# EAGLE design C3427-3 (EAGLE 7.2.0)
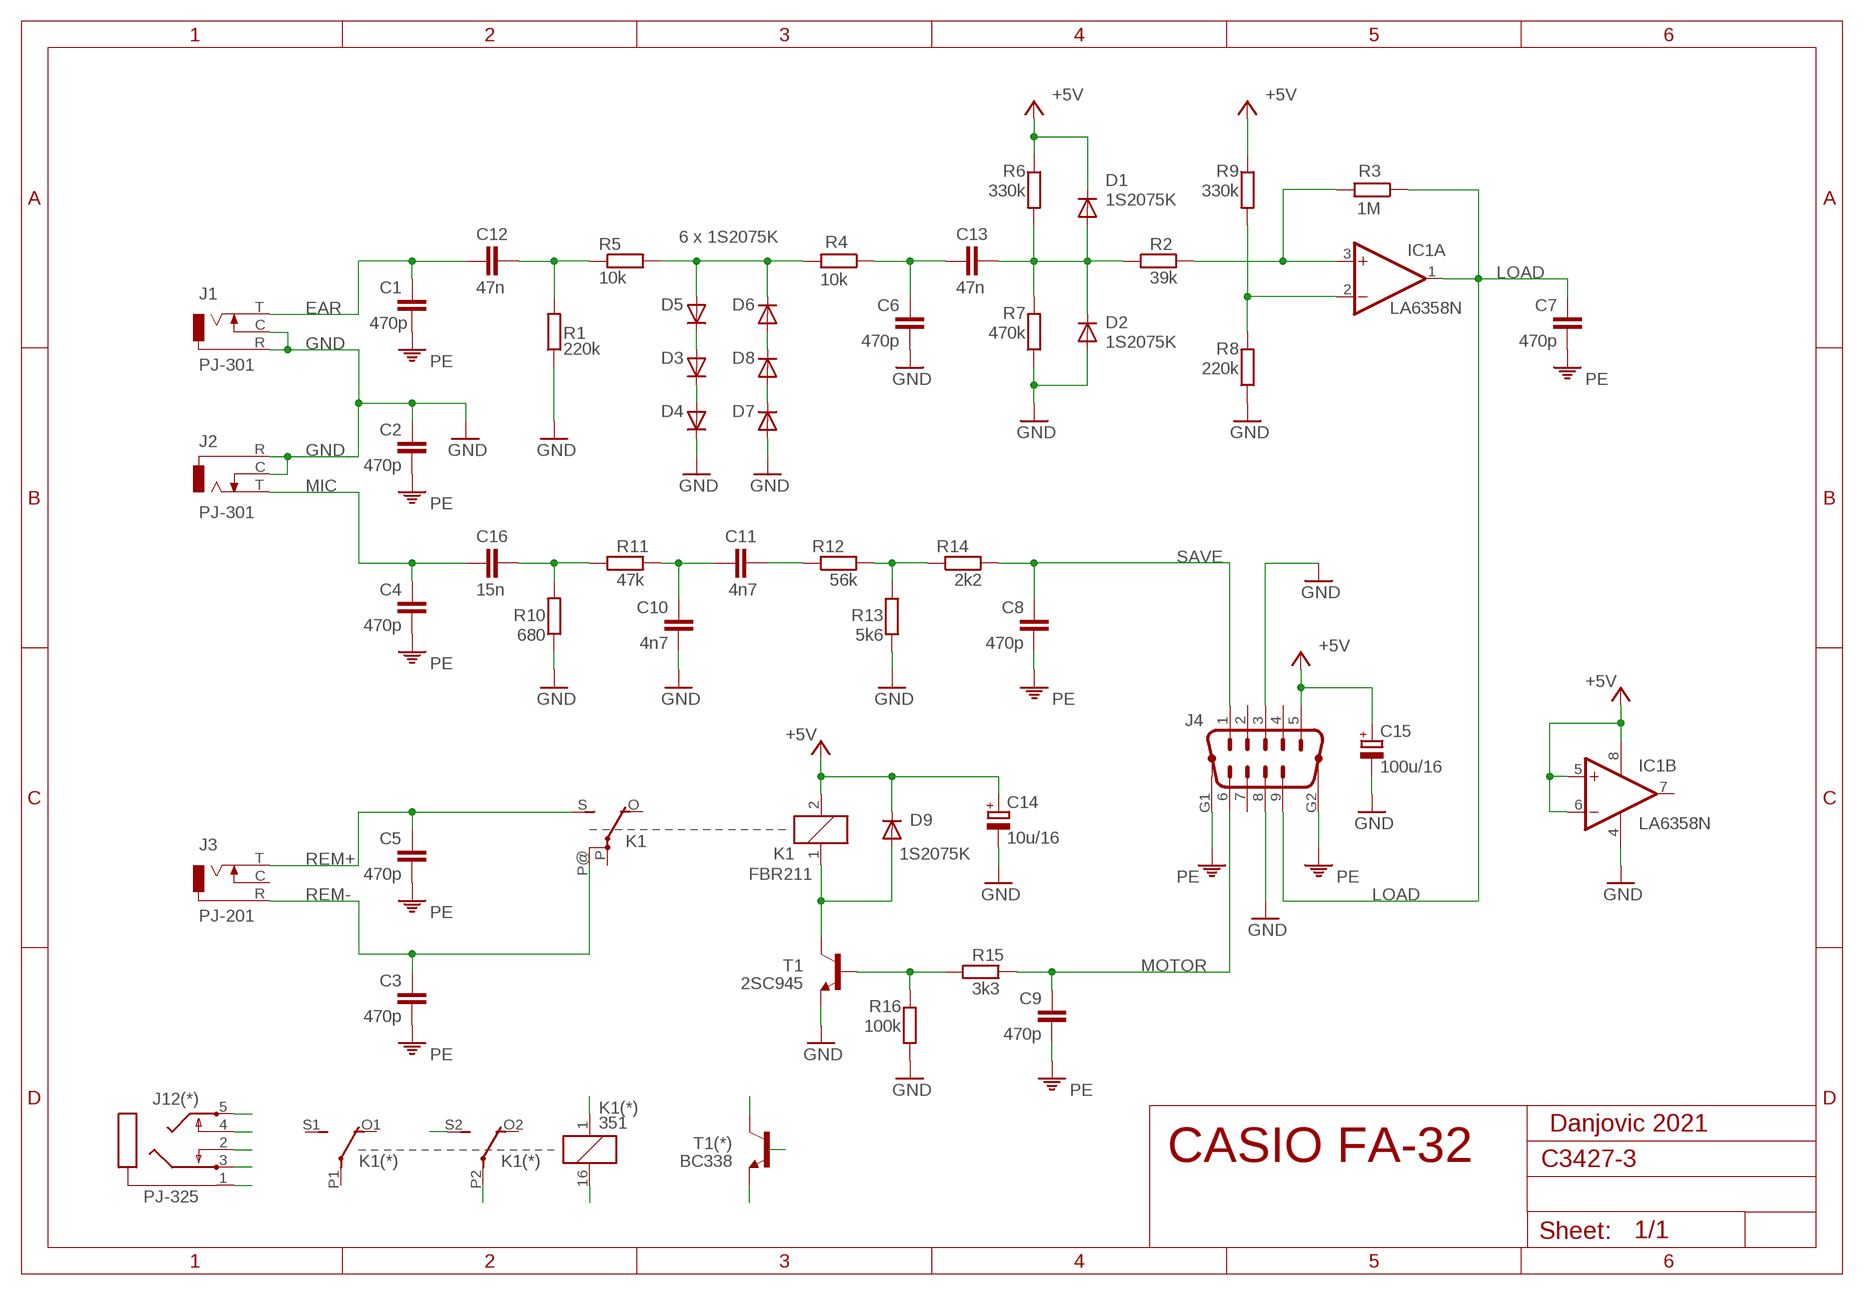
[diagram p0: schematic, sheet 1]

## Parts
C1  470p  C-EU050-024X044  [C050-024X044]
C2  470p  C-EU050-024X044  [C050-024X044]
C3  470p  C-EU050-024X044  [C050-024X044]
C4  470p  C-EU050-024X044  [C050-024X044]
C5  470p  C-EU050-024X044  [C050-024X044]
C6  470p  C-EU050-024X044  [C050-024X044]
C7  470p  C-EU050-024X044  [C050-024X044]
C8  470p  C-EU050-024X044  [C050-024X044]
C9  470p  C-EU050-024X044  [C050-024X044]
C10  4n7  C-EU050-024X044  [C050-024X044]
C11  4n7  C-EU050-024X044  [C050-024X044]
C12  47n  C-EU050-045X075  [C050-045X075]
C13  47n  C-EU050-045X075  [C050-045X075]
C14  10u/16  CPOL-EUE2-4  [E2-4]
C15  100u/16  CPOL-EUE2.5-6  [E2,5-6]
C16  15n  C-EU050-024X044  [C050-024X044]
D1  1S2075K  DIODE-D-7.5  [D-7.5]
D2  1S2075K  DIODE-D-7.5  [D-7.5]
D3  1S2075K  DIODE-D-7.5  [D-7.5]
D4  1S2075K  DIODE-D-7.5  [D-7.5]
D5  1S2075K  DIODE-D-7.5  [D-7.5]
D6  1S2075K  DIODE-D-7.5  [D-7.5]
D7  1S2075K  DIODE-D-7.5  [D-7.5]
D8  1S2075K  DIODE-D-7.5  [D-7.5]
D9  1S2075K  DIODE-D-7.5  [D-7.5]
IC1  LA6358N  LM358N  [DIL08]
J1  PJ-301  [PJ301]
J2  PJ-301  [PJ301]
J3  PJ-201  [PJ201]
J4  M09HP  [M09HP]
J12(*)  PJ-325  [PJ325]
K1  FBR211  FRS1B  [FRS1B]
K1(*)  351  [351]
R1  220k  R-EU_0204/7  [0204/7]
R2  39k  R-EU_0204/7  [0204/7]
R3  1M  R-EU_0204/7  [0204/7]
R4  10k  R-EU_0204/7  [0204/7]
R5  10k  R-EU_0204/7  [0204/7]
R6  330k  R-EU_0204/7  [0204/7]
R7  470k  R-EU_0204/7  [0204/7]
R8  220k  R-EU_0204/7  [0204/7]
R9  330k  R-EU_0204/7  [0204/7]
R10  680  R-EU_0204/7  [0204/7]
R11  47k  R-EU_0204/7  [0204/7]
R12  56k  R-EU_0204/7  [0204/7]
R13  5k6  R-EU_0204/7  [0204/7]
R14  2k2  R-EU_0204/7  [0204/7]
R15  3k3  R-EU_0204/7  [0204/7]
R16  100k  R-EU_0204/7  [0204/7]
T1  2SC945  [TO92-ECB]
T1(*)  BC338  [TO92-EBC]

## Nets
+5V: C14.+ C15.+ D1.C D9.C IC1.5(B:+IN) IC1.6(B:-IN) IC1.8(P:V+) J4.5 K1(*).1 K1.2 R6.1 R9.1
EAR: C1.2 C12.2 J1.T J12(*).5
GND: C2.2 C6.1 C10.1 C14.- C15.- D2.A D4.C D7.A IC1.4(P:V-) J1.C J1.R J2.C J2.R J4.3 J4.8 J12(*).1 J12(*).2 J12(*).4 R1.1 R7.1 R8.1 R10.1 R13.2 R16.2 T1(*).E T1.E
LOAD: C7.2 IC1.1(A:OUT) J4.9 R3.1
MIC: C4.2 C16.2 J2.T J12(*).3
MOTOR: C9.2 J4.6 R15.2
N$2: D5.A D6.C R4.2 R5.2
N$3: C12.1 R1.2 R5.1
N$4: C6.2 C13.2 R4.1
N$5: C16.1 R10.2 R11.1
N$9: D9.A K1(*).16 K1.1 T1(*).C T1.C
N$10: R15.1 R16.1 T1(*).B T1.B
N$15: D3.A D5.C
N$16: D3.C D4.A
N$17: D6.A D8.C
N$18: D7.C D8.A
N$19: C13.1 D1.A D2.C R2.1 R6.2 R7.2
N$20: R12.2 R13.1 R14.1
N$21: C10.2 C11.1 R11.2
N$22: C11.2 R12.1
N$23: IC1.2(A:-IN) R8.2 R9.2
N$25: IC1.3(A:+IN) R2.2 R3.2
PE: C1.1 C2.1 C3.1 C4.1 C5.1 C7.1 C8.1 C9.1 J4.G1 J4.G2
REM+: C5.2 J3.T K1(*).P2(3:P) K1.S(2:S)
REM-: C3.2 J3.R K1(*).S2(3:S) K1.P@(2:P)
SAVE: C8.2 J4.1 R14.2
Unconnected: IC1.7(B:OUT) J3.C J4.2 J4.4 J4.7 K1(*).O1(2:O) K1(*).O2(3:O) K1(*).P1(2:P) K1(*).S1(2:S) K1.O(2:O) K1.P(2:P)

## Notes on the sheet
- 6 x 1S2075K
- Danjovic 2021
- CASIO FA-32

## Library data of the parts
C1-C13 C16 = rcl:C-EU: CAPACITOR, European symbol
C14 C15 = rcl:CPOL-EU: POLARIZED CAPACITOR, European symbol
D1-D9 = diode:DIODE-: DIODE
IC1 = linear:LM358: OP AMP also LM158; LM258; LM2904 Source: http://cache.national.com/ds/LM/LM158.pdf
J1-J3 = Jack-PJ:PJ-: Mono Jack
J4 = con-subd:M09HP: SUB-D; OC_FARNELL: unknown; OC_NEWARK: unknown
J12(*) = AudioJack:PJ-325: Stereo Jack With Switches
K1 = relay:FRS1B: RELAY 1 x switch, same as V23101-D6-A201, Siemens; OC_FARNELL: unknown; OC_NEWARK: unknown
K1(*) = relay:351: RELAY 2 x switch, Omron; OC_FARNELL: unknown; OC_NEWARK: unknown
R1-R16 = resistor:R-EU_: RESISTOR, European symbol
T1 = transistor:2SC945: NPN Silicon Epitaxial Planar Transistor Source: SEMTECH ELECTRONICS LTD. ... 2SC945 2.pdf
T1(*) = transistor-npn:BC338*: NPN Transistor

## Board
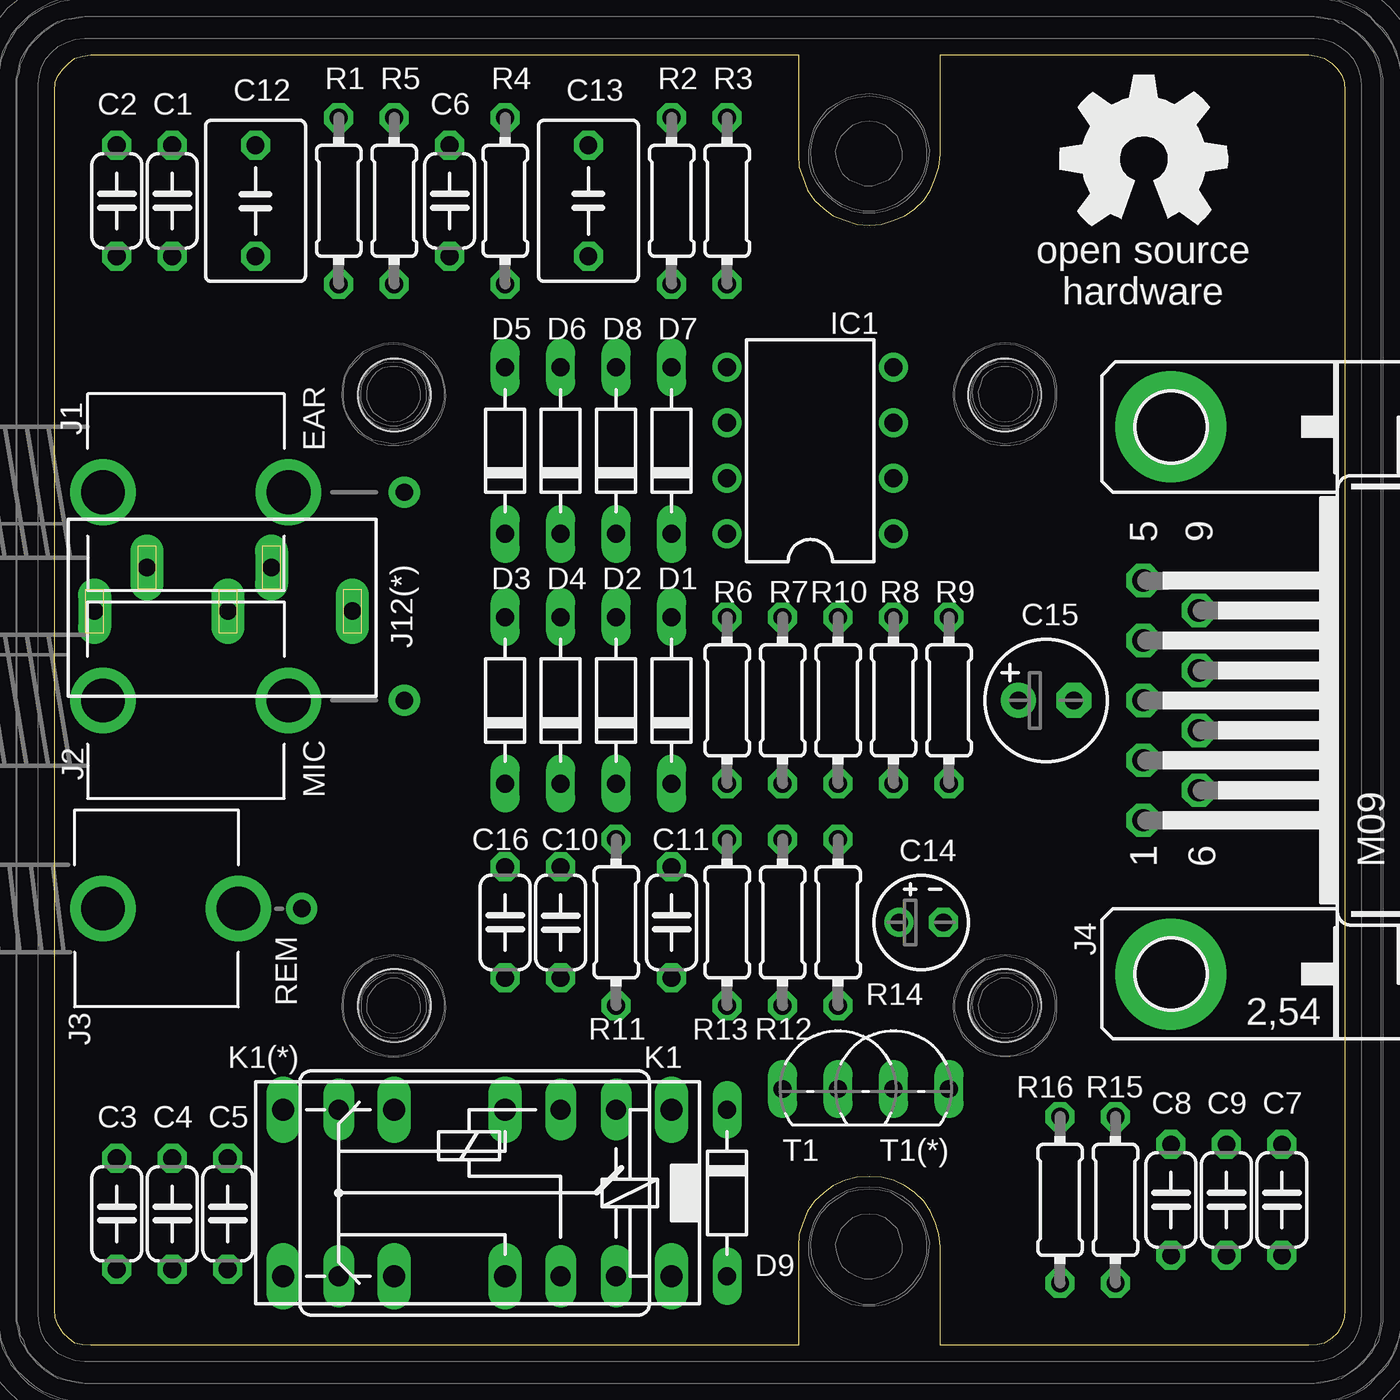
[diagram p1: board, top side]
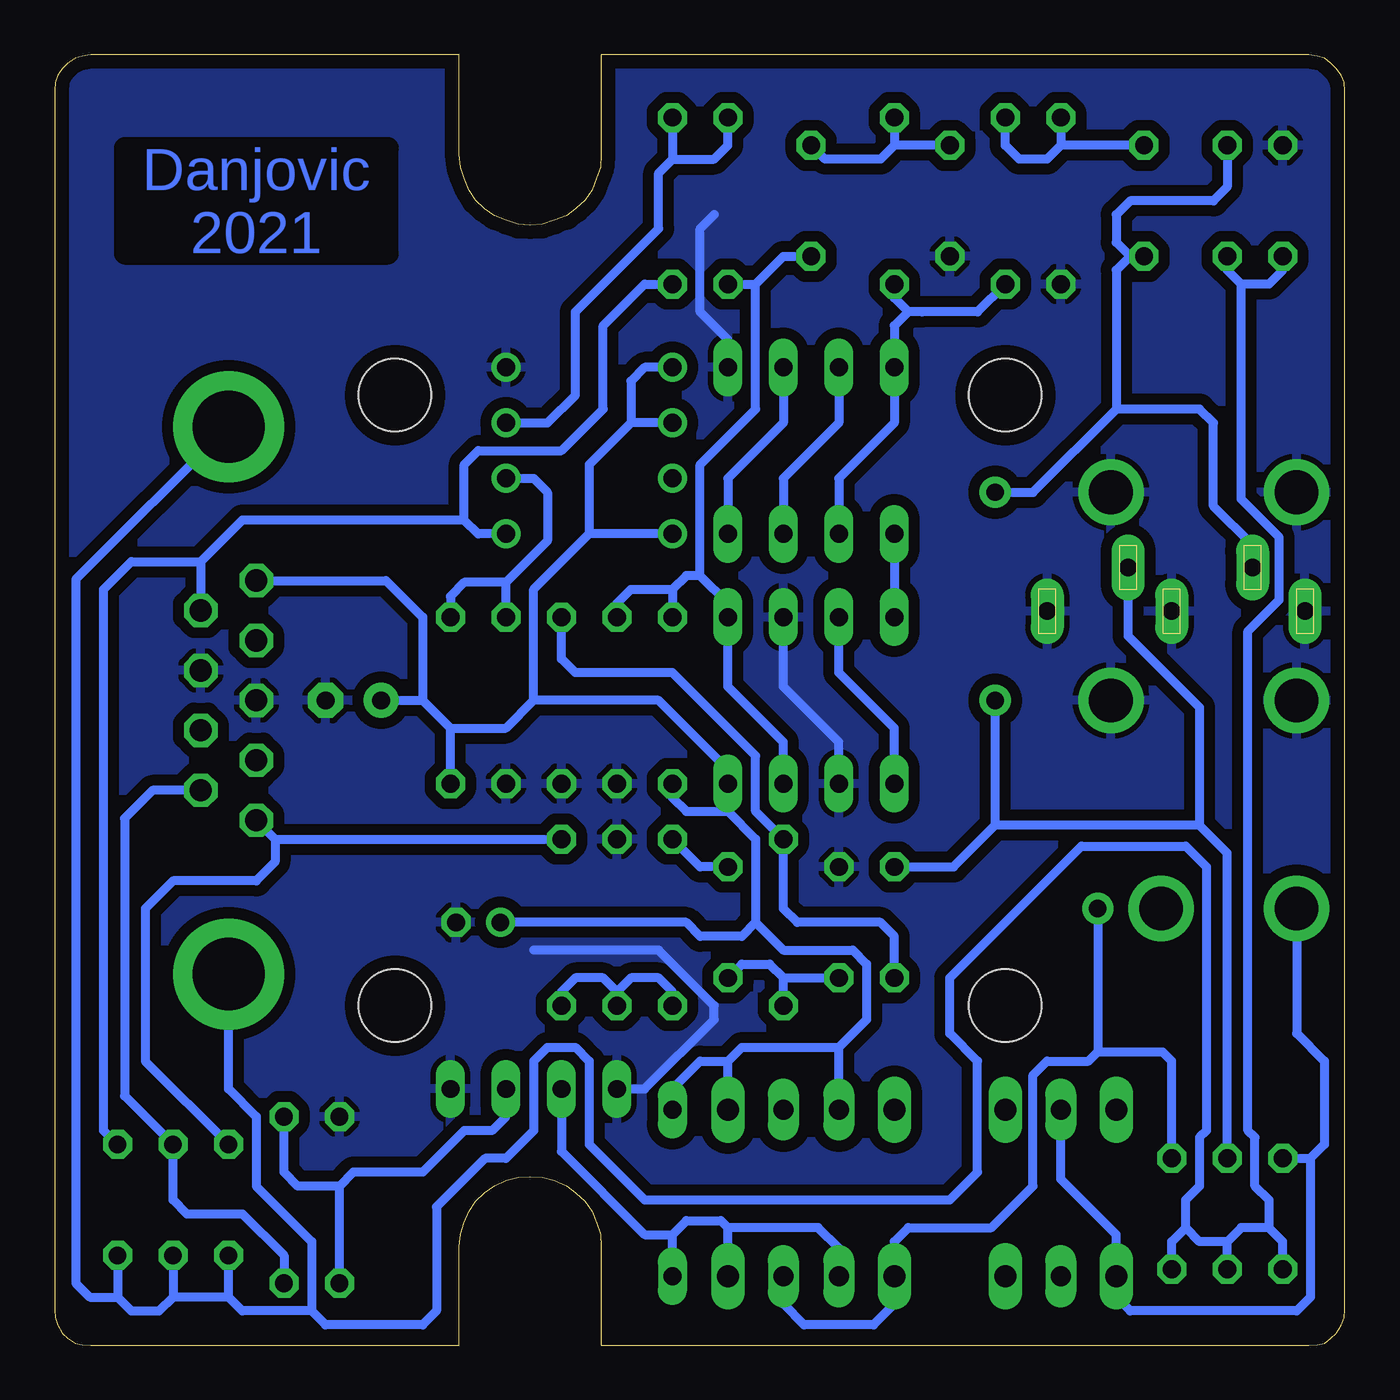
[diagram p2: board, bottom side, seen from below]

Size 59.07 x 59.07 mm. Coordinates in mm from the lower left corner, seen from the top.
Copper layers (1*16): Top 0.035mm / dielectric 1.5mm / Bottom 0.035mm
Design rules "default *": minimum track width 10mil, minimum drill 24mil, track to track 8mil, track to pad 8mil, pad to pad 8mil, via to via 8mil, smd to smd 8mil, copper to edge 25mil, drill to drill 8mil, minimum pad ring 10mil, minimum via ring 8mil, stop-mask expansion 4mil, vias tented up to drill 0mil, thermal gap 10mil

### Footprints (pad centres in the part's own frame; a part is rotated, then mirrored left to right if it is on the bottom)
C050-024X044 = drill 0.813 octagon: 1 -2.54,0; 2 2.54,0
C050-045X075 = drill 0.813 octagon: 1 -2.54,0; 2 2.54,0
E2-4 = drill 0.813 pad 1.27: + -1.016,0 | drill 0.813 pad 1.27 octagon: - 1.016,0
E2,5-6 = drill 0.813 pad 1.6: + -1.27,0 | drill 0.813 pad 1.6 octagon: - 1.27,0
D-7.5 = drill 0.813 long: A 3.81,0; C -3.81,0
DIL08 = drill 0.813 pad 1.27: 1 -3.81,-3.81; 2 -1.27,-3.81; 3 1.27,-3.81; 4 3.81,-3.81; 5 3.81,3.81; 6 1.27,3.81; 7 -1.27,3.81; 8 -3.81,3.81
PJ301 = drill 2: C 0,8.5; R 0,0 | drill 0.8 pad 1.422: T 0,13.8
PJ201 = drill 2: C 0,6.2; R 0,0 | drill 0.8 pad 1.422: T 0,9.1
M09HP = drill 1.016 octagon: 1 -5.486,1.27; 2 -2.743,1.27; 3 0,1.27; 4 2.743,1.27; 5 5.486,1.27; 6 -4.115,-1.27; 7 -1.372,-1.27; 8 1.372,-1.27; 9 4.115,-1.27 | drill 3.302 pad 5.08: G1 -12.522,0; G2 12.522,0
PJ325 = drill 0.8 pad 1.5 long: 1 1.2,-1; 2 7.3,-1; 3 9.3,1; 4 13,-1; 5 3.6,1
FRS1B = drill 0.914 long: 1 0,3.81; 2 0,-3.81; O -2.54,-3.81; P 10.16,3.81; P@ 10.16,-3.81; S -2.54,3.81
351 = drill 1.016 long: 1 -3.81,-3.81; 16 -3.81,3.81; O1 8.89,-3.81; O2 8.89,3.81; P1 3.81,-3.81; P2 3.81,3.81; S1 13.97,-3.81; S2 13.97,3.81
0204/7 = drill 0.813 octagon: 1 -3.81,0; 2 3.81,0
TO92-ECB = drill 0.813 long: B 2.54,0; C 0,0; E -2.54,0
TO92-EBC = drill 0.813 long: B 0,-1.27; C -2.54,-1.27; E 2.54,-1.27
1593J = hole 3.302: -13.97,-13.97; 13.97,-13.97; -13.97,13.97; 13.97,13.97

### Placement (x,y rotation side)
C1  5.39,52.38 90 top
C2  2.85,52.38 90 top
C3  2.85,6.02 90 top
C4  5.39,6.02 90 top
C5  7.93,6.02 90 top
C6  18.09,52.38 90 top
C7  56.19,6.66 90 top
C8  51.11,6.66 90 top
C9  53.65,6.66 90 top
C10  23.17,19.36 270 top
C11  28.25,19.36 90 top
C12  9.2,52.38 270 top
C13  24.44,52.38 90 top
C14  39.68,19.36 0 top
C15  45.39,29.52 0 top
C16  20.63,19.36 90 top
D1  28.25,29.52 90 top
D2  25.71,29.52 90 top
D3  20.63,29.52 90 top
D4  23.17,29.52 90 top
D5  20.63,40.95 90 top
D6  23.17,40.95 90 top
D7  28.25,40.95 90 top
D8  25.71,40.95 90 top
D9  30.79,6.97 270 top
IC1  34.6,40.95 90 top
J1  2.21,39.04 270 top
J2  2.21,29.52 270 top
J3  2.21,19.99 270 top
J4  51.11,29.52 90 top
J12(*)  0.63,34.6 0 top
K1  23.17,6.97 180 top
K1(*)  24.44,6.97 180 top
R1  13.01,52.38 90 top
R2  28.25,52.38 90 top
R3  30.79,52.38 90 top
R4  20.63,52.38 270 top
R5  15.55,52.38 270 top
R6  30.79,29.52 90 top
R7  33.33,29.52 90 top
R8  38.41,29.52 90 top
R9  40.95,29.52 90 top
R10  35.87,29.52 90 top
R11  25.71,19.36 270 top
R12  30.79,19.36 270 top
R13  33.33,19.36 90 top
R14  35.87,19.36 90 top
R15  48.57,6.66 270 top
R16  46.03,6.66 90 top
T1  35.87,11.74 0 top
T1(*)  38.41,13.01 0 top
U$1  [OSHW_8MM]  49.84,54.28 0 top
U$2  [1593J]  29.52,29.52 90 top

### Tracks (layer width: path | path; a pad name or v marks a point on that pad's centre or on a via)
+5V
  Bottom 0.406: 28.25,24.44 D1.C 28.25,26.34 31.42,29.52 37.14,29.52 | 28.25,24.44 26.98,23.17 26.98,19.36 | 26.98,19.36 27.61,18.72 29.52,18.72 30.15,19.36 C14.+ | R6.1 30.79,25.07 30.15,24.44 28.25,24.44 | 37.14,29.52 37.14,34.6 34.6,37.14 | R9.1 40.95,28.25 | 40.95,28.25 38.41,28.25 37.14,29.52 | C15.+ 42.22,29.52 | 42.22,29.52 40.95,28.25 | J4.5 43.89,35 42.22,33.33 42.22,29.52 | IC1.5 32.06,44.76 32.69,44.12 32.69,42.22 | 32.69,42.22 34.6,40.31 34.6,37.14 | IC1.8 34.6,37.14 | IC1.6 32.69,42.22 | 26.98,19.36 25.71,18.09 22.53,18.09 21.9,17.45 21.9,14.91 23.17,13.64 | K1(*).1 28.25,13.01 | 28.25,13.01 27.61,13.64 23.17,13.64 | D9.C 30.79,11.74 29.52,13.01 28.25,13.01 | K1.2 23.17,13.64
EAR
  Bottom 0.406: C1.2 5.39,53.01 6.02,52.38 9.83,52.38 10.47,51.74 10.47,50.47 9.83,49.84 | J12(*).5 4.23,36.61 6.02,38.41 6.02,42.22 6.66,42.85 10.47,42.85 | 9.83,49.84 10.47,49.2 10.47,42.85 | C12.2 9.83,49.84 | J1.T 14.28,39.04 10.47,42.85
GND
  Bottom 0.406: D4.C 23.17,27.61 25.71,30.15 D2.A | D7.A 28.25,46.03 29.52,47.3 29.52,51.11 28.88,51.74 | T1.E 32.06,11.74 28.88,14.91 28.88,15.55 31.42,18.09 37.14,18.09
  pour Bottom (isolate 0.508): -0.96,-0.96 60,-0.96 60,60 -0.96,60
LOAD
  Bottom 0.406: C7.2 56.82,9.83 56.82,34.6 55.55,35.87 52.38,35.87 | 52.38,35.87 J4.9 | R3.1 32.06,48.57 33.96,46.66 33.96,42.85 35.87,40.95 39.68,40.95 40.31,40.31 40.31,37.77 | IC1.1 39.68,37.14 40.31,37.77 | 40.31,37.77 50.47,37.77 52.38,35.87
MIC
  Bottom 0.406: C4.2 5.39,22.53 6.66,23.8 | 6.66,23.8 16.01,23.8 | J2.T 16.01,23.8 | C16.2 17.92,21.9 16.01,23.8 | 6.66,23.8 6.66,29.2 9.92,32.47 J12(*).3
MOTOR
  Bottom 0.406: J4.6 54.59,25.4 55.87,24.12 55.87,11.42 C9.2 53.65,6.66 53.01,6.02 50.47,6.02 48.57,4.12 R15.2
N$2
  Bottom 0.406: D6.C 23.17,39.68 20.63,42.22 D5.A 20.63,46.66 19.99,47.3 | R5.2 16.82,47.3 19.36,47.3 19.99,47.3 | 19.99,47.3 20.63,47.93 R4.2
N$3
  Bottom 0.406: C12.1 13.01,54.92 | 13.01,54.92 13.64,54.28 14.91,54.28 15.55,54.92 R5.1 | R1.2 13.01,54.92
N$4
  Bottom 0.406: C6.2 20.63,54.92 | 20.63,54.92 21.26,54.28 23.8,54.28 C13.2 | R4.1 20.63,54.92
N$5
  Bottom 0.406: C16.1 20.63,18.72 21.26,19.36 25.07,19.36 25.71,19.99 R11.1 26.98,24.44 26.98,26.98 30.79,30.79 35.23,30.79 35.87,31.42 R10.2
N$9
  Bottom 0.406: K1.1 23.17,4.43 24.12,5.39 28.25,5.39 | K1(*).16 28.25,5.39 | T1(*).C 35.87,8.88 32.06,5.07 30.79,5.07 | 30.79,5.07 30.15,5.71 28.57,5.71 28.25,5.39 | D9.A 30.79,5.07
N$10
  Bottom 0.406: T1(*).B 38.41,10.47 39.04,9.83 40.31,9.83 42.22,7.93 45.39,7.93 46.03,7.29 | 46.03,7.29 47.93,7.29 48.57,7.93 R15.1 | R16.1 46.03,7.29
N$15
  Bottom 0.406: D5.C D3.A
N$16
  Bottom 0.406: D3.C 20.63,28.25 23.17,30.79 D4.A
N$17
  Bottom 0.406: D6.A 23.17,42.22 25.71,39.68 D8.C
N$18
  Bottom 0.406: D8.A 25.71,42.22 28.25,39.68 D7.C
N$19
  Bottom 0.406: D2.C 25.71,27.61 28.25,30.15 D1.A 28.25,33.96 29.52,35.23 | R7.2 33.33,33.96 32.69,34.6 30.79,34.6 | 30.79,34.6 R6.2 | 29.52,35.23 30.15,35.23 30.79,34.6 | R2.1 26.98,48.57 | 26.98,48.57 25.71,49.84 C13.1 | 29.52,35.23 29.52,40.31 26.98,42.85 26.98,48.57
N$20
  Bottom 0.406: R14.1 35.87,16.18 35.23,16.82 33.96,16.82 33.33,16.18 | R12.2 30.79,16.18 31.42,16.82 32.69,16.82 33.33,16.18 | R13.1 33.33,16.18
N$21
  Bottom 0.406: C11.1 27.61,17.45 26.34,17.45 25.71,16.82 | 25.71,16.82 C10.2 | R11.2 25.71,16.82
N$22
  Bottom 0.406: C11.2 29.52,21.9 R12.1
N$23
  Bottom 0.406: IC1.2 37.14,39.68 36.5,39.04 36.5,36.82 38.41,34.91 | 38.41,34.91 40.31,34.91 40.95,34.28 R9.2 | R8.2 38.41,34.91
N$25
  Bottom 0.406: IC1.3 36.5,42.22 35.23,43.49 35.23,47.3 31.42,51.11 31.42,53.65 30.79,54.28 | 30.79,54.28 28.88,54.28 28.25,54.92 R2.2 | R3.2 30.79,54.28
PE
  Bottom 0.406: 51.11,2.21 53.65,2.21 | 47.3,1.58 46.66,0.94 42.22,0.94 41.58,1.58 41.58,6.34 39.36,8.56 38.41,8.56 37.14,9.83 37.14,13.01 36.5,13.64 35.23,13.64 34.6,13.01 34.6,9.2 32.06,6.66 18.09,6.66 16.82,7.93 16.82,13.01 18.09,14.28 18.09,16.82 12.06,22.85 7.29,22.85 6.34,21.9 6.34,9.83 6.66,9.52 6.66,7.29 7.29,6.66 7.29,5.39 | 47.3,1.58 50.47,1.58 51.11,2.21 | 51.11,2.21 C8.1 | C1.1 5.39,49.2 4.75,48.57 | C2.1 2.85,49.2 3.48,48.57 4.75,48.57 | 47.3,1.58 47.3,4.75 49.84,7.29 49.84,10.47 51.11,11.74 J4.G1 | J4.G2 58.09,35.05 58.09,2.85 57.46,2.21 56.19,2.21 | 56.19,2.21 55.55,1.58 54.28,1.58 53.65,2.21 | C9.1 53.65,2.21 | C7.1 56.19,2.21 | 4.75,48.57 4.75,38.73 3.01,36.98 3.01,34.12 4.43,32.69 4.43,9.83 4.12,9.52 4.12,7.29 3.48,6.66 3.48,5.39 | C3.1 2.85,4.75 3.48,5.39 | 3.48,5.39 4.75,5.39 5.39,4.75 | 5.39,4.75 6.66,4.75 7.29,5.39 | C4.1 5.39,4.75 | C5.1 7.93,4.75 7.29,5.39
REM+
  Bottom 0.406: K1.S 25.71,1.9 24.75,0.94 21.58,0.94 20.63,1.9 K1(*).P2 20.63,4.75 19.99,5.39 16.18,5.39 14.28,7.29 14.28,12.37 13.64,13.01 11.74,13.01 11.31,13.43 | J3.T 11.31,13.43 | C5.2 7.93,13.01 8.35,13.43 11.31,13.43
REM-
  Bottom 0.406: J3.R 2.21,14.28 0.94,13.01 0.94,9.2 1.58,8.56 | K1.P@ 13.01,7.61 10.47,5.07 K1(*).S2 10.47,2.21 9.83,1.58 2.21,1.58 1.58,2.21 1.58,8.56 | C3.2 1.58,8.56
SAVE
  Bottom 0.406: 48.97,23.17 R14.2 | C8.2 54.92,13.01 54.92,19.99 53.65,21.26 49.84,21.26 48.97,22.13 48.97,23.17 | 48.97,23.17 J4.1

### Text on the board
Bottom: Danjovic / 2021
tPlace: EAR | MIC | REM